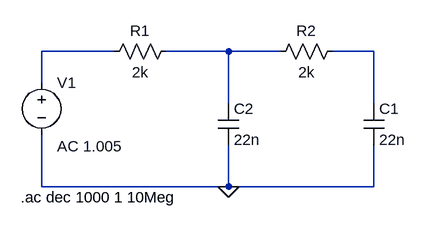
[diagram p0: schematic circuit3.asc]
circuit3.asc, the LTspice schematic file:
Version 4.1
SHEET 1 880 680
WIRE 112 80 0 80
WIRE 288 80 192 80
WIRE 368 80 288 80
WIRE 512 80 448 80
WIRE 0 128 0 80
WIRE 288 160 288 80
WIRE 512 160 512 80
WIRE 0 288 0 208
WIRE 288 288 288 224
WIRE 288 288 0 288
WIRE 512 288 512 224
WIRE 512 288 288 288
FLAG 288 288 0
SYMBOL voltage 0 112 R0
WINDOW 123 24 114 Left 2
WINDOW 39 0 0 Left 0
SYMATTR Value2 AC 1.005
SYMATTR InstName V1
SYMATTR Value ""
SYMBOL res 208 64 R90
WINDOW 0 0 56 VBottom 2
WINDOW 3 32 56 VTop 2
SYMATTR InstName R1
SYMATTR Value 2k
SYMBOL res 464 64 R90
WINDOW 0 0 56 VBottom 2
WINDOW 3 32 56 VTop 2
SYMATTR InstName R2
SYMATTR Value 2k
SYMBOL cap 496 160 R0
SYMATTR InstName C1
SYMATTR Value 22n
SYMBOL cap 272 160 R0
SYMATTR InstName C2
SYMATTR Value 22n
TEXT -32 304 Left 2 !.ac dec 1000 1 10Meg

The netlist it stands for:
* circuit3.asc
V1 N001 0 AC 1.005
R1 N002 N001 2k
R2 N003 N002 2k
C1 N003 0 22n
C2 N002 0 22n
.ac dec 1000 1 10Meg
.backanno
.end